# Altium schematic sheet 2-Current_sense.SchDoc
size A
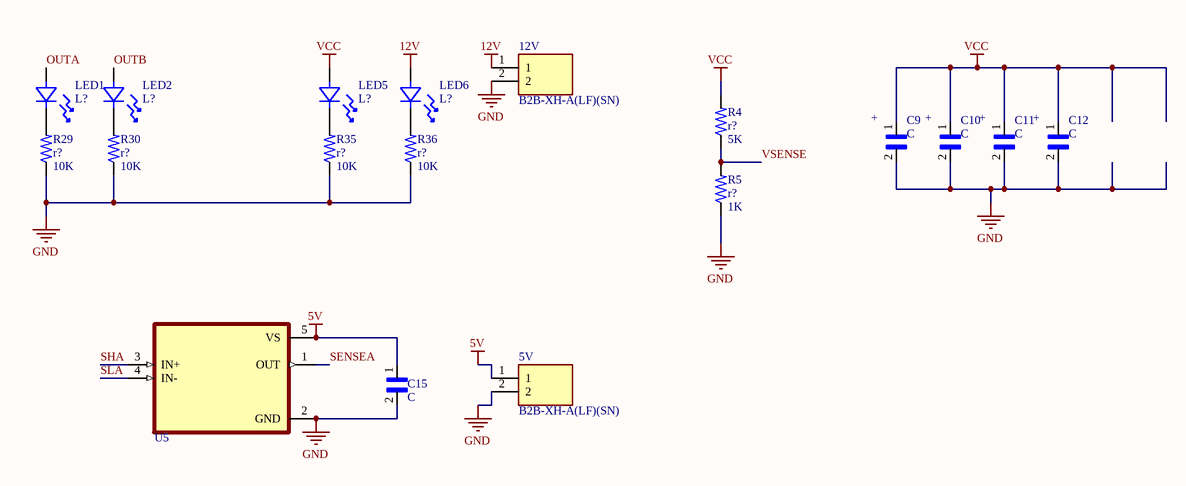
[diagram p0: 2-Current_sense.SchDoc]

## Parts
5V  B2B-XH-A(LF)(SN)  [JST_B2B-XH-A(LF)(SN)]
12V  B2B-XH-A(LF)(SN)  [JST_B2B-XH-A(LF)(SN)]
C9  C  [CAP-8*10.2]
C10  C  [CAP-8*10.2]
C11  C  [CAP-8*10.2]
C12  C  [CAP-8*10.2]
C15  C  [cap 1206]
LED1  L?  [LED_0805]
LED2  L?  [LED_0805]
LED5  L?  [LED_0805]
LED6  L?  [LED_0805]
R4  r?  value 5K  [RES-0805]
R5  r?  value 1K  [RES-0805]
R29  r?  value 10K  [RES-0805]
R30  r?  value 10K  [RES-0805]
R35  r?  value 10K  [RES-0805]
R36  r?  value 10K  [RES-0805]
U5  INA180A4-GAIN200  [SOT23-5]  (value not drawn)

## Nets
5V: 5V.1 C15.1 U5.5(VS)
12V: 12V.1 LED6.1
GND: 5V.2 12V.2 C9.2 C10.2 C11.2 C12.2 C15.2 R5.1 R29.1 R30.1 R35.1 R36.1 U5.2(GND)
VCC: C9.1 C10.1 C11.1 C12.1 LED5.1 R4.2
OUTA: LED1.1
OUTB: LED2.1
SENSEA: U5.1(OUT)
SHA: U5.3(IN+)
SLA: U5.4(IN-)
VSENSE: R4.1 R5.2
NetLED1_2: LED1.2 R29.2
NetLED2_2: LED2.2 R30.2
NetLED5_2: LED5.2 R35.2
NetLED6_2: LED6.2 R36.2

## Notes on the sheet
- (in symbol Cap 8*10.2) +

## Library data of the parts
5V 12V = B2B-XH-A(LF)(SN): Connector Header Through Hole 2 position 0.098 _2.50mm_; MP: B2B-XH-A_LF__SN_; MF: JST Sales; Price: None; Package: None; Value: *; Availability: Unavailable; SnapEDA_Link: https://www.snapeda.com/parts/B2B-XH-A%28LF%29%28SN%29/JST%20Sales%20America%20Inc./view-part/492310/?ref=snap
C9 = Cap 8*10.2: Film Capacitor; Value: 100uf; MP: CB018B0103JBA; MF: AVX; Price: None; Package: 1206 AVX; Availability: Unavailable; SnapEDA_Link: https://www.snapeda.com/parts/CB018B0103JBA/AVX/view-part/2283023/?ref=snap
C10-C12 = Cap 8*10.2: Film Capacitor; MP: CB018B0103JBA; MF: AVX; Price: None; Package: 1206 AVX; Value: *; Availability: Unavailable; SnapEDA_Link: https://www.snapeda.com/parts/CB018B0103JBA/AVX/view-part/2283023/?ref=snap
C15 = Cap 1206: Film Capacitor; Value: 0.1uf; MP: CB018B0103JBA; MF: AVX; Price: None; Package: 1206 AVX; Availability: Unavailable; SnapEDA_Link: https://www.snapeda.com/parts/CB018B0103JBA/AVX/view-part/2283023/?ref=snap
LED1 LED2 LED5 LED6 = led-0805: KÄ±rmÄ±zÄ± LED GÃ¶stergesi - AyrÄ±k 2V 0805 (2012 Metrik); MP: CMD17-21VRC/TR8; MF: Visual; DigiKey-Purchase-URL: https://snapeda.com/shop?store=DigiKey&id=570104; Package: 0805 VCC; Availability: Unavailable; Value: *; Price: None; SnapEDA_Link: https://www.snapeda.com/parts/CMD17-21VRC/TR8/Visual%20Communications%20Company%20-%20VCC/view-part/570104/?ref=snap
R4 R5 R29 R30 R35 R36 = Res-0805: Res, Thin Film, 16r5, 0.1%, 0.25w, 0805; MP: RP73PF2A16R5BTDF; MF: TE Connectivity; SnapEDA_Link: https://www.snapeda.com/parts/RP73PF2A16R5BTDF/TE%20Connectivity/view-part/1047398/?ref=snap; Package: 0805 TE Connectivity; Availability: Unavailable; Price: None
U5 = INA180A4-GAIN200: 26V, 350kHz current sense amplifier 5-SOT-23 -40 to 125; MF: Texas Instruments; MP: INA180A3IDBVR; Value: *; Price: None; Mouser-Purchase-URL: https://snapeda.com/shop?store=Mouser&id=1129654; Package: SOT-23-5 Texas Instruments; Availability: Good; DigiKey-Purchase-URL: https://snapeda.com/shop?store=DigiKey&id=1129654; SnapEDA_Link: https://www.snapeda.com/parts/INA180A3IDBVR/Texas%20Instruments/view-part/1129654/?ref=snap; Texas_Instruments-Purchase-URL: https://snapeda.com/shop?store=Texas+Instruments&id=1129654